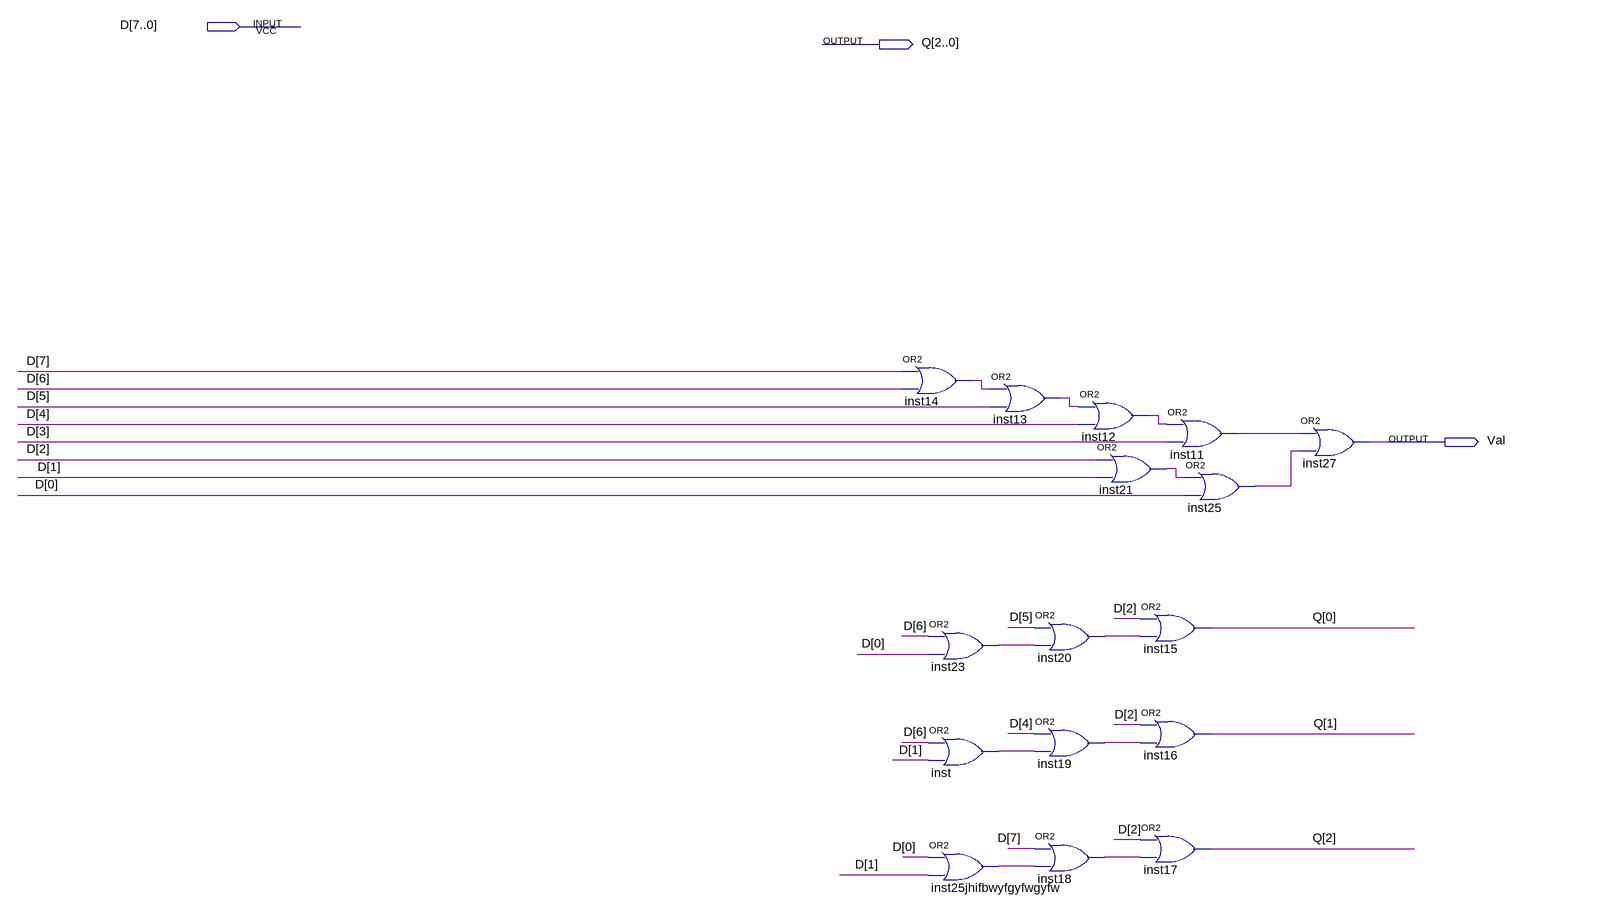
[diagram p0: schematic sheet]
// Quartus schematic encodernew.bdf as structural Verilog: 16 symbols, 3 pins
module encodernew (
  input  [7:0] D,
  output [2:0] Q,
  output Val
);

  wire inst11_out, inst12_out, inst13_out, inst14_out, inst18_out, inst19_out, inst20_out, inst21_out,
       inst23_out, inst25_out, inst25jhifbwyfgyfwgyfw_out, inst_out;

  or inst14 (inst14_out, D[7], D[6]);
  or inst23 (inst23_out, D[6], D[0]);
  or inst (inst_out, D[6], D[1]);
  or inst25jhifbwyfgyfwgyfw (inst25jhifbwyfgyfwgyfw_out, D[0], D[1]);
  or inst13 (inst13_out, inst14_out, D[5]);
  or inst12 (inst12_out, inst13_out, D[4]);
  or inst20 (inst20_out, D[5], inst23_out);
  or inst19 (inst19_out, D[4], inst_out);
  or inst18 (inst18_out, D[7], inst25jhifbwyfgyfwgyfw_out);
  or inst21 (inst21_out, D[2], D[1]);
  or inst15 (Q[0], D[2], inst20_out);
  or inst16 (Q[1], D[2], inst19_out);
  or inst17 (Q[2], D[2], inst18_out);
  or inst11 (inst11_out, inst12_out, D[3]);
  or inst25 (inst25_out, inst21_out, D[0]);
  or inst27 (Val, inst11_out, inst25_out);
endmodule
